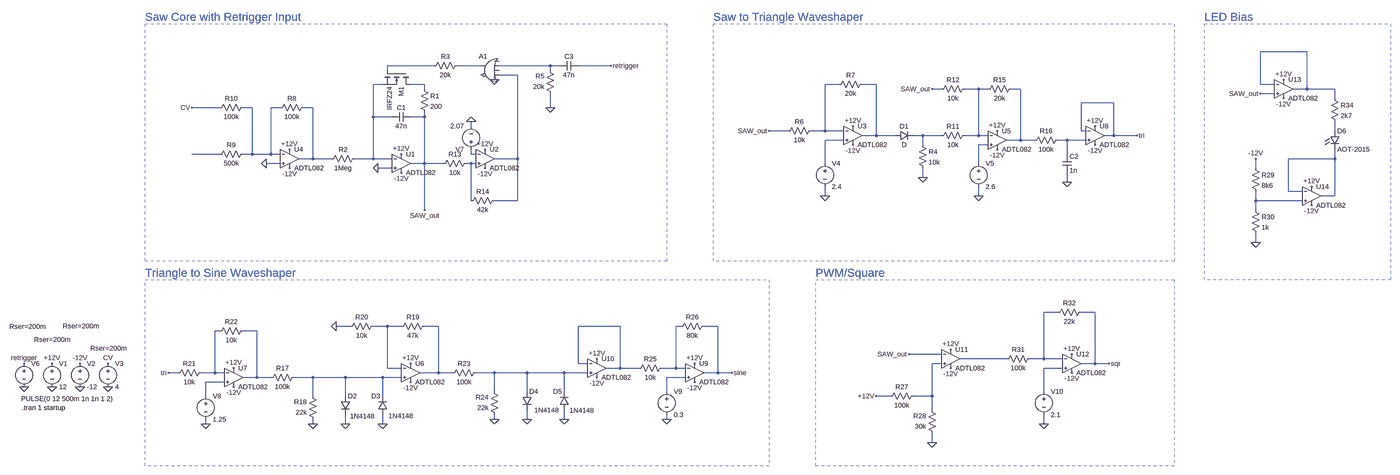
[diagram p0: schematic LFO with trigger.asc, whole sheet]
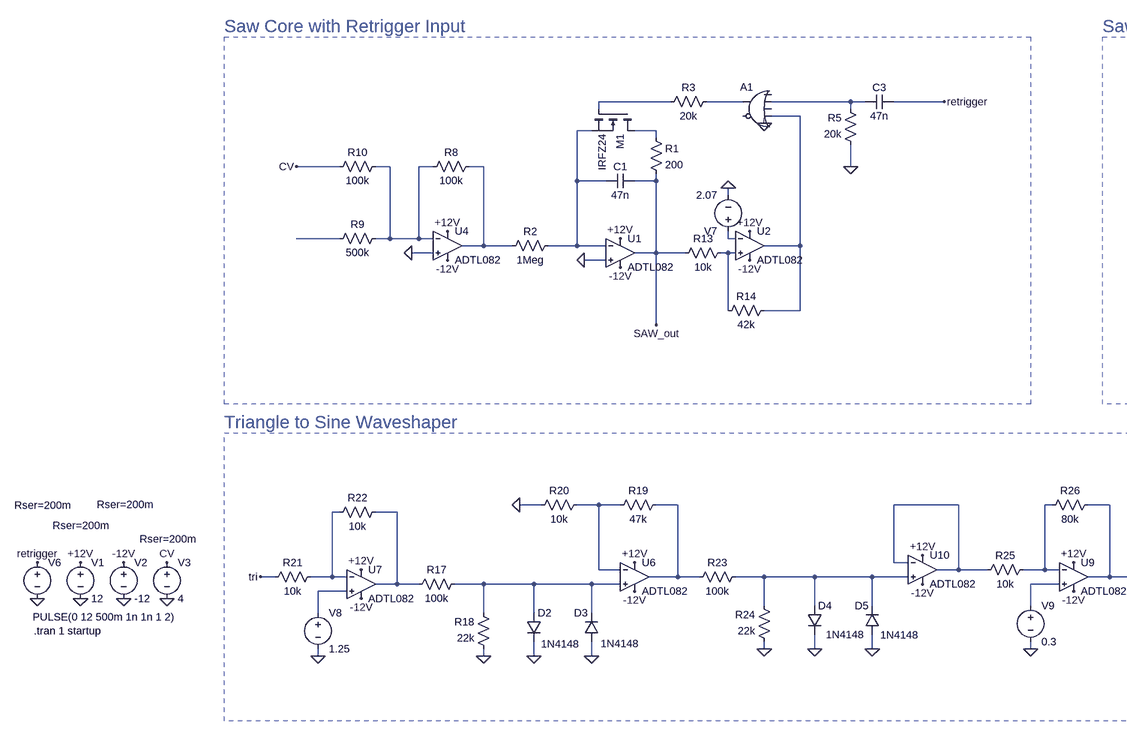
[diagram p1: schematic LFO with trigger.asc, part, row 1 of 1, column 1 of 2]
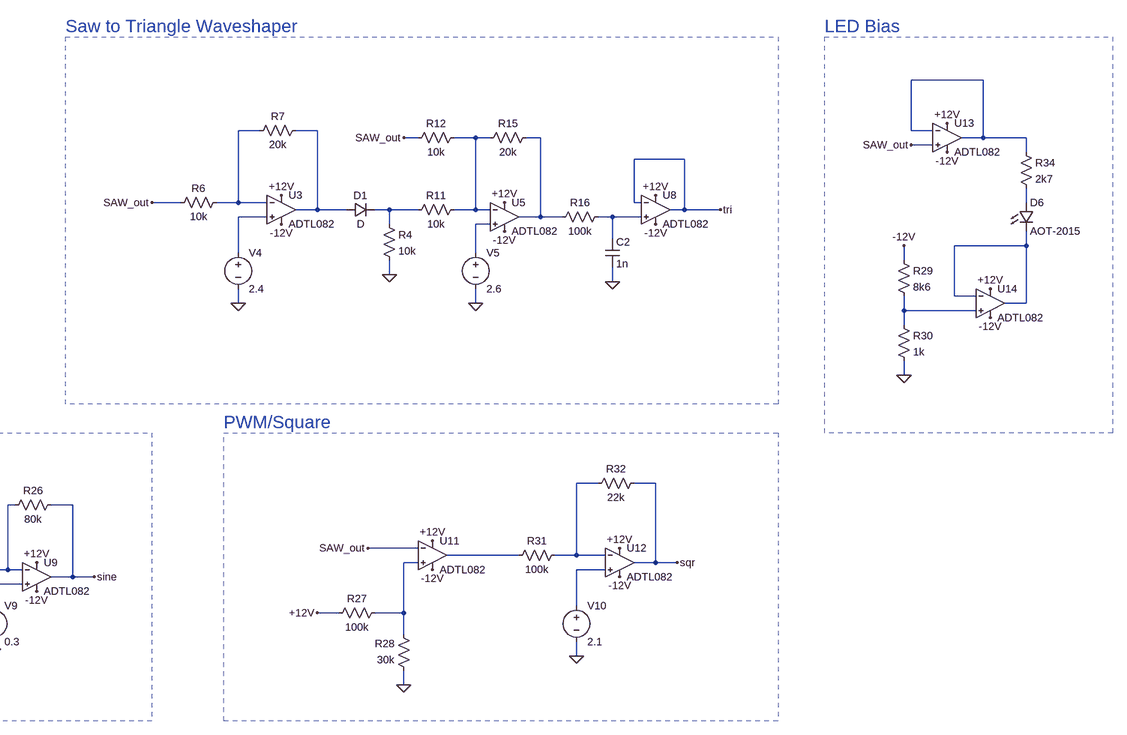
[diagram p2: schematic LFO with trigger.asc, part, row 1 of 1, column 2 of 2]
LFO with trigger.asc, the LTspice schematic file:
Version 4
SHEET 1 6664 1796
WIRE 4800 -768 4640 -768
WIRE 1760 -720 1600 -720
WIRE 1920 -720 1840 -720
WIRE 2160 -720 1984 -720
WIRE 2192 -720 2160 -720
WIRE 2368 -720 2256 -720
WIRE 1600 -704 1600 -720
WIRE 2160 -704 2160 -720
WIRE 2048 -688 1984 -688
WIRE 1584 -656 1552 -656
WIRE 1728 -656 1680 -656
WIRE 3152 -656 3104 -656
WIRE 3280 -656 3232 -656
WIRE 4640 -656 4640 -768
WIRE 4688 -656 4640 -656
WIRE 1728 -640 1728 -656
WIRE 3504 -640 3472 -640
WIRE 3632 -640 3584 -640
WIRE 3664 -640 3632 -640
WIRE 3776 -640 3744 -640
WIRE 4800 -640 4800 -768
WIRE 4800 -640 4752 -640
WIRE 4896 -640 4800 -640
WIRE 4688 -624 4640 -624
WIRE 4896 -608 4896 -640
WIRE 4096 -592 3984 -592
WIRE 1024 -576 928 -576
WIRE 1136 -576 1104 -576
WIRE 1232 -576 1200 -576
WIRE 1344 -576 1312 -576
WIRE 2160 -576 2160 -624
WIRE 1552 -544 1552 -656
WIRE 1616 -544 1552 -544
WIRE 1728 -544 1728 -560
WIRE 1728 -544 1680 -544
WIRE 1888 -512 1888 -528
WIRE 2976 -496 2912 -496
WIRE 3104 -496 3104 -656
WIRE 3104 -496 3056 -496
WIRE 3168 -496 3104 -496
WIRE 3984 -496 3984 -592
WIRE 4000 -496 3984 -496
WIRE 4896 -496 4896 -528
WIRE 3280 -480 3280 -656
WIRE 3280 -480 3232 -480
WIRE 3344 -480 3280 -480
WIRE 3440 -480 3408 -480
WIRE 3504 -480 3440 -480
WIRE 3632 -480 3632 -640
WIRE 3632 -480 3584 -480
WIRE 3664 -480 3632 -480
WIRE 4096 -480 4096 -592
WIRE 4096 -480 4064 -480
WIRE 4176 -480 4096 -480
WIRE 3168 -464 3104 -464
WIRE 3776 -464 3776 -640
WIRE 3776 -464 3728 -464
WIRE 3824 -464 3776 -464
WIRE 3936 -464 3904 -464
WIRE 4000 -464 3936 -464
WIRE 3440 -448 3440 -480
WIRE 3664 -448 3632 -448
WIRE 1024 -416 928 -416
WIRE 1136 -416 1136 -576
WIRE 1136 -416 1104 -416
WIRE 1200 -416 1200 -576
WIRE 1200 -416 1136 -416
WIRE 1232 -416 1200 -416
WIRE 1888 -416 1888 -432
WIRE 1904 -416 1888 -416
WIRE 3936 -416 3936 -464
WIRE 1344 -400 1344 -576
WIRE 1344 -400 1296 -400
WIRE 1408 -400 1344 -400
WIRE 1552 -400 1552 -544
WIRE 1552 -400 1488 -400
WIRE 1616 -400 1552 -400
WIRE 2048 -400 2048 -688
WIRE 2048 -400 1968 -400
WIRE 4896 -400 4896 -432
WIRE 4896 -400 4736 -400
WIRE 1232 -384 1184 -384
WIRE 1728 -384 1728 -544
WIRE 1728 -384 1680 -384
WIRE 1792 -384 1728 -384
WIRE 1888 -384 1872 -384
WIRE 1904 -384 1888 -384
WIRE 3104 -384 3104 -464
WIRE 3632 -384 3632 -448
WIRE 1616 -368 1568 -368
WIRE 4624 -368 4624 -400
WIRE 3440 -336 3440 -368
WIRE 3936 -320 3936 -352
WIRE 4736 -288 4736 -400
WIRE 4784 -288 4736 -288
WIRE 3104 -272 3104 -304
WIRE 3632 -272 3632 -304
WIRE 4896 -272 4896 -400
WIRE 4896 -272 4848 -272
WIRE 1888 -256 1888 -384
WIRE 2048 -256 2048 -400
WIRE 2048 -256 1968 -256
WIRE 4624 -256 4624 -288
WIRE 4784 -256 4624 -256
WIRE 1728 -224 1728 -384
WIRE 4624 -224 4624 -256
WIRE 4624 -112 4624 -144
WIRE 3904 128 3856 128
WIRE 4032 128 3984 128
WIRE 1472 176 1424 176
WIRE 1600 176 1552 176
WIRE 1648 176 1600 176
WIRE 1776 176 1728 176
WIRE 2400 176 2256 176
WIRE 2608 176 2592 176
WIRE 2736 176 2688 176
WIRE 1024 192 1008 192
WIRE 1152 192 1104 192
WIRE 3504 272 3392 272
WIRE 3728 288 3568 288
WIRE 3856 288 3856 128
WIRE 3856 288 3808 288
WIRE 3920 288 3856 288
WIRE 2256 304 2256 176
WIRE 2288 304 2256 304
WIRE 3504 304 3472 304
WIRE 4032 304 4032 128
WIRE 4032 304 3984 304
WIRE 4080 304 4032 304
WIRE 1600 320 1600 176
WIRE 1648 320 1600 320
WIRE 2400 320 2400 176
WIRE 2400 320 2352 320
WIRE 2464 320 2400 320
WIRE 2592 320 2592 176
WIRE 2592 320 2544 320
WIRE 2624 320 2592 320
WIRE 3920 320 3856 320
WIRE 880 336 848 336
WIRE 1008 336 1008 192
WIRE 1008 336 960 336
WIRE 1040 336 1008 336
WIRE 1776 336 1776 176
WIRE 1776 336 1712 336
WIRE 1824 336 1776 336
WIRE 1968 336 1904 336
WIRE 2080 336 1968 336
WIRE 2208 336 2080 336
WIRE 2288 336 2208 336
WIRE 2736 336 2736 176
WIRE 2736 336 2688 336
WIRE 2784 336 2736 336
WIRE 1152 352 1152 192
WIRE 1152 352 1104 352
WIRE 1200 352 1152 352
WIRE 1344 352 1280 352
WIRE 1456 352 1344 352
WIRE 1584 352 1456 352
WIRE 1648 352 1584 352
WIRE 2624 352 2560 352
WIRE 1040 368 976 368
WIRE 1968 400 1968 336
WIRE 2080 400 2080 336
WIRE 2208 400 2208 336
WIRE 2560 400 2560 352
WIRE 3856 400 3856 320
WIRE 976 416 976 368
WIRE 1344 416 1344 352
WIRE 1456 416 1456 352
WIRE 1584 416 1584 352
WIRE 3328 416 3280 416
WIRE 3472 416 3472 304
WIRE 3472 416 3408 416
WIRE 3472 464 3472 416
WIRE 1968 496 1968 480
WIRE 2080 496 2080 464
WIRE 2208 496 2208 464
WIRE 2560 496 2560 480
WIRE 976 512 976 496
WIRE 1344 512 1344 496
WIRE 1456 512 1456 480
WIRE 1584 512 1584 480
WIRE 3856 512 3856 480
WIRE 3472 576 3472 544
FLAG 448 384 0
FLAG 544 384 0
FLAG 640 384 0
FLAG 448 304 +12V
FLAG 544 304 -12V
FLAG 640 304 CV
FLAG 1648 -416 +12V
FLAG 1648 -352 -12V
FLAG 1568 -368 0
FLAG 1264 -432 +12V
FLAG 1264 -368 -12V
FLAG 1184 -384 0
FLAG 928 -576 CV
FLAG 352 384 0
FLAG 352 304 retrigger
FLAG 1888 -528 0
FLAG 1936 -432 +12V
FLAG 1936 -368 -12V
FLAG 2368 -720 retrigger
FLAG 2160 -576 0
FLAG 1968 -672 0
FLAG 1728 -224 SAW_out
FLAG 2912 -496 SAW_out
FLAG 3200 -512 +12V
FLAG 3200 -448 -12V
FLAG 3440 -336 0
FLAG 3104 -272 0
FLAG 3696 -496 +12V
FLAG 3696 -432 -12V
FLAG 3472 -640 SAW_out
FLAG 3632 -272 0
FLAG 3936 -320 0
FLAG 1344 512 0
FLAG 1456 512 0
FLAG 1584 512 0
FLAG 4176 -480 tri
FLAG 848 336 tri
FLAG 1072 320 +12V
FLAG 1072 384 -12V
FLAG 976 512 0
FLAG 4032 -512 +12V
FLAG 4032 -448 -12V
FLAG 1680 304 +12V
FLAG 1680 368 -12V
FLAG 1424 176 0
FLAG 1968 496 0
FLAG 2080 496 0
FLAG 2208 496 0
FLAG 2656 304 +12V
FLAG 2656 368 -12V
FLAG 2560 496 0
FLAG 2320 288 +12V
FLAG 2320 352 -12V
FLAG 2784 336 sine
FLAG 3536 256 +12V
FLAG 3536 320 -12V
FLAG 3472 576 0
FLAG 3280 416 +12V
FLAG 3392 272 SAW_out
FLAG 3952 272 +12V
FLAG 3952 336 -12V
FLAG 3856 512 0
FLAG 4080 304 sqr
FLAG 4720 -672 +12V
FLAG 4720 -608 -12V
FLAG 4640 -624 SAW_out
FLAG 4816 -304 +12V
FLAG 4816 -240 -12V
FLAG 4624 -400 -12V
FLAG 4624 -112 0
SYMBOL voltage 448 288 R0
WINDOW 123 0 0 Left 0
WINDOW 39 -62 -66 Left 2
SYMATTR SpiceLine Rser=200m
SYMATTR InstName V1
SYMATTR Value 12
SYMBOL voltage 544 288 R0
WINDOW 123 0 0 Left 0
WINDOW 39 -60 -113 Left 2
SYMATTR SpiceLine Rser=200m
SYMATTR InstName V2
SYMATTR Value -12
SYMBOL voltage 640 288 R0
WINDOW 123 0 0 Left 0
WINDOW 39 -61 -36 Left 2
SYMATTR SpiceLine Rser=200m
SYMATTR InstName V3
SYMATTR Value 4
SYMBOL OpAmps\\ADTL082 1648 -448 R0
SYMATTR InstName U1
SYMBOL cap 1680 -560 R90
WINDOW 0 0 32 VBottom 2
WINDOW 3 32 32 VTop 2
SYMATTR InstName C1
SYMATTR Value 47n
SYMBOL res 1504 -416 R90
WINDOW 0 0 56 VBottom 2
WINDOW 3 32 56 VTop 2
SYMATTR InstName R2
SYMATTR Value 1Meg
SYMBOL OpAmps\\ADTL082 1264 -464 R0
SYMATTR InstName U4
SYMBOL res 1328 -592 R90
WINDOW 0 0 56 VBottom 2
WINDOW 3 32 56 VTop 2
SYMATTR InstName R8
SYMATTR Value 100k
SYMBOL res 1120 -432 R90
WINDOW 0 0 56 VBottom 2
WINDOW 3 32 56 VTop 2
SYMATTR InstName R9
SYMATTR Value 500k
SYMBOL res 1120 -592 R90
WINDOW 0 0 56 VBottom 2
WINDOW 3 32 56 VTop 2
SYMATTR InstName R10
SYMATTR Value 100k
SYMBOL voltage 352 288 R0
WINDOW 123 0 0 Left 0
WINDOW 39 75 -111 Right 2
WINDOW 3 -10 137 Left 2
SYMATTR SpiceLine Rser=200m
SYMATTR Value PULSE(0 12 500m 1n 1n 1 2)
SYMATTR InstName V6
SYMBOL nmos 1680 -704 R90
SYMATTR InstName M1
SYMATTR Value IRFZ24
SYMBOL res 1712 -656 R0
SYMATTR InstName R1
SYMATTR Value 200
SYMBOL voltage 1888 -416 R180
WINDOW 123 0 0 Left 0
WINDOW 39 0 0 Left 0
SYMATTR InstName V7
SYMATTR Value 2.07
SYMBOL OpAmps\\ADTL082 1936 -464 R0
SYMATTR InstName U2
SYMBOL res 1888 -400 R90
WINDOW 0 0 56 VBottom 2
WINDOW 3 32 56 VTop 2
SYMATTR InstName R13
SYMATTR Value 10k
SYMBOL res 1984 -272 R90
WINDOW 0 0 56 VBottom 2
WINDOW 3 32 56 VTop 2
SYMATTR InstName R14
SYMATTR Value 42k
SYMBOL cap 2256 -736 R90
WINDOW 0 0 32 VBottom 2
WINDOW 3 32 32 VTop 2
SYMATTR InstName C3
SYMATTR Value 47n
SYMBOL res 2176 -608 R180
WINDOW 0 36 76 Left 2
WINDOW 3 36 40 Left 2
SYMATTR InstName R5
SYMATTR Value 20k
SYMBOL Digital\\or 1952 -768 M0
WINDOW 3 0 0 Invisible 0
SYMATTR Value Ref=1
SYMATTR InstName A1
SYMATTR Value2 Vhigh=10 Vlow=0
SYMBOL res 1856 -736 R90
WINDOW 0 0 56 VBottom 2
WINDOW 3 32 56 VTop 2
SYMATTR InstName R3
SYMATTR Value 20k
SYMBOL diode 3344 -464 R270
WINDOW 0 32 32 VTop 2
WINDOW 3 0 32 VBottom 2
SYMATTR InstName D1
SYMBOL res 3424 -464 R0
SYMATTR InstName R4
SYMATTR Value 10k
SYMBOL res 3072 -512 R90
WINDOW 0 0 56 VBottom 2
WINDOW 3 32 56 VTop 2
SYMATTR InstName R6
SYMATTR Value 10k
SYMBOL OpAmps\\ADTL082 3200 -544 R0
SYMATTR InstName U3
SYMBOL res 3248 -672 R90
WINDOW 0 0 56 VBottom 2
WINDOW 3 32 56 VTop 2
SYMATTR InstName R7
SYMATTR Value 20k
SYMBOL voltage 3104 -400 R0
WINDOW 123 0 0 Left 0
WINDOW 39 0 0 Left 0
SYMATTR InstName V4
SYMATTR Value 2.4
SYMBOL res 3600 -496 R90
WINDOW 0 0 56 VBottom 2
WINDOW 3 32 56 VTop 2
SYMATTR InstName R11
SYMATTR Value 10k
SYMBOL res 3600 -656 R90
WINDOW 0 0 56 VBottom 2
WINDOW 3 32 56 VTop 2
SYMATTR InstName R12
SYMATTR Value 10k
SYMBOL res 3760 -656 R90
WINDOW 0 0 56 VBottom 2
WINDOW 3 32 56 VTop 2
SYMATTR InstName R15
SYMATTR Value 20k
SYMBOL OpAmps\\ADTL082 3696 -528 R0
SYMATTR InstName U5
SYMBOL voltage 3632 -400 R0
WINDOW 123 0 0 Left 0
WINDOW 39 0 0 Left 0
SYMATTR InstName V5
SYMATTR Value 2.6
SYMBOL cap 3920 -416 R0
SYMATTR InstName C2
SYMATTR Value 1n
SYMBOL res 3920 -480 R90
WINDOW 0 0 56 VBottom 2
WINDOW 3 32 56 VTop 2
SYMATTR InstName R16
SYMATTR Value 100k
SYMBOL res 1296 336 R90
WINDOW 0 0 56 VBottom 2
WINDOW 3 32 56 VTop 2
SYMATTR InstName R17
SYMATTR Value 100k
SYMBOL res 1360 512 R180
WINDOW 0 36 76 Left 2
WINDOW 3 36 40 Left 2
SYMATTR InstName R18
SYMATTR Value 22k
SYMBOL diode 1440 416 R0
WINDOW 3 32 69 Left 2
SYMATTR Value 1N4148
SYMATTR InstName D2
SYMBOL diode 1600 480 R180
WINDOW 0 24 64 Left 2
WINDOW 3 -89 -4 Left 2
SYMATTR InstName D3
SYMATTR Value 1N4148
SYMBOL OpAmps\\ADTL082 1072 288 R0
SYMATTR InstName U7
SYMBOL res 976 320 R90
WINDOW 0 0 56 VBottom 2
WINDOW 3 32 56 VTop 2
SYMATTR InstName R21
SYMATTR Value 10k
SYMBOL res 1120 176 R90
WINDOW 0 0 56 VBottom 2
WINDOW 3 32 56 VTop 2
SYMATTR InstName R22
SYMATTR Value 10k
SYMBOL voltage 976 400 R0
WINDOW 123 0 0 Left 0
WINDOW 39 0 0 Left 0
SYMATTR InstName V8
SYMATTR Value 1.25
SYMBOL OpAmps\\ADTL082 4032 -544 R0
SYMATTR InstName U8
SYMBOL OpAmps\\ADTL082 1680 272 R0
SYMATTR InstName U6
SYMBOL res 1744 160 R90
WINDOW 0 0 56 VBottom 2
WINDOW 3 32 56 VTop 2
SYMATTR InstName R19
SYMATTR Value 47k
SYMBOL res 1568 160 R90
WINDOW 0 0 56 VBottom 2
WINDOW 3 32 56 VTop 2
SYMATTR InstName R20
SYMATTR Value 10k
SYMBOL res 1920 320 R90
WINDOW 0 0 56 VBottom 2
WINDOW 3 32 56 VTop 2
SYMATTR InstName R23
SYMATTR Value 100k
SYMBOL res 1984 496 R180
WINDOW 0 36 76 Left 2
WINDOW 3 36 40 Left 2
SYMATTR InstName R24
SYMATTR Value 22k
SYMBOL diode 2064 400 R0
WINDOW 3 162 65 Left 2
SYMATTR Value 1N4148
SYMATTR InstName D4
SYMBOL diode 2224 464 R180
WINDOW 0 24 64 Left 2
WINDOW 3 34 0 Left 2
SYMATTR InstName D5
SYMATTR Value 1N4148
SYMBOL OpAmps\\ADTL082 2656 272 R0
SYMATTR InstName U9
SYMBOL res 2560 304 R90
WINDOW 0 0 56 VBottom 2
WINDOW 3 32 56 VTop 2
SYMATTR InstName R25
SYMATTR Value 10k
SYMBOL res 2704 160 R90
WINDOW 0 0 56 VBottom 2
WINDOW 3 32 56 VTop 2
SYMATTR InstName R26
SYMATTR Value 80k
SYMBOL voltage 2560 384 R0
WINDOW 123 0 0 Left 0
WINDOW 39 0 0 Left 0
SYMATTR InstName V9
SYMATTR Value 0.3
SYMBOL OpAmps\\ADTL082 2320 256 R0
SYMATTR InstName U10
SYMBOL OpAmps\\ADTL082 3536 224 R0
SYMATTR InstName U11
SYMBOL res 3424 400 R90
WINDOW 0 0 56 VBottom 2
WINDOW 3 32 56 VTop 2
SYMATTR InstName R27
SYMATTR Value 100k
SYMBOL res 3488 560 R180
WINDOW 0 36 76 Left 2
WINDOW 3 36 40 Left 2
SYMATTR InstName R28
SYMATTR Value 30k
SYMBOL res 3824 272 R90
WINDOW 0 0 56 VBottom 2
WINDOW 3 32 56 VTop 2
SYMATTR InstName R31
SYMATTR Value 100k
SYMBOL OpAmps\\ADTL082 3952 240 R0
SYMATTR InstName U12
SYMBOL res 4000 112 R90
WINDOW 0 0 56 VBottom 2
WINDOW 3 32 56 VTop 2
SYMATTR InstName R32
SYMATTR Value 22k
SYMBOL voltage 3856 384 R0
WINDOW 123 0 0 Left 0
WINDOW 39 0 0 Left 0
SYMATTR InstName V10
SYMATTR Value 2.1
SYMBOL OpAmps\\ADTL082 4720 -704 R0
SYMATTR InstName U13
SYMBOL LED 4880 -496 R0
SYMATTR InstName D6
SYMATTR Value AOT-2015
SYMBOL res 4880 -624 R0
SYMATTR InstName R34
SYMATTR Value 2k7
SYMBOL OpAmps\\ADTL082 4816 -336 R0
SYMATTR InstName U14
SYMBOL res 4608 -384 R0
SYMATTR InstName R29
SYMATTR Value 8k6
SYMBOL res 4608 -240 R0
SYMATTR InstName R30
SYMATTR Value 1k
TEXT 344 456 Left 2 !.tran 1 startup
TEXT 768 -888 Left 4 ;Saw Core with Retrigger Input
TEXT 2720 -888 Left 4 ;Saw to Triangle Waveshaper
TEXT 768 -8 Left 4 ;Triangle to Sine Waveshaper
TEXT 3072 -8 Left 4 ;PWM/Square
TEXT 4448 -888 Left 4 ;LED Bias
RECTANGLE Normal 2560 -48 768 -864 2
RECTANGLE Normal 4304 -48 2720 -864 2
RECTANGLE Normal 2912 656 768 16 2
RECTANGLE Normal 4304 656 3072 16 2
RECTANGLE Normal 5088 16 4448 -864 2

The netlist it stands for:
* LFO with trigger.asc
V1 +12V 0 12 Rser=200m
V2 -12V 0 -12 Rser=200m
V3 CV 0 4 Rser=200m
XU1 0 N006 +12V -12V SAW_out ADTL082  ; pins In+ In- V+ V- OUT
C1 SAW_out N006 47n
R2 N006 N013 1Meg
XU4 0 N012 +12V -12V N013 ADTL082  ; pins In+ In- V+ V- OUT
R8 N013 N012 100k
R9 N012 N019 500k
R10 N012 CV 100k
V6 retrigger 0 PULSE(0 12 500m 1n 1n 1 2) Rser=200m
M1 N007 N002 N006 N006 IRFZ24
R1 N007 SAW_out 200
V7 N020 0 2.07
XU2 N022 N020 +12V -12V N005 ADTL082  ; pins In+ In- V+ V- OUT
R13 N022 SAW_out 10k
R14 N005 N022 42k
C3 retrigger N004 47n
R5 0 N004 20k
A1 0 N004 0 N005 0 0 N003 0 OR Ref=1 Vhigh=10 Vlow=0
R3 N003 N002 20k
D1 N009 N015 D
R4 N015 0 10k
R6 N008 SAW_out 10k
XU3 N016 N008 +12V -12V N009 ADTL082  ; pins In+ In- V+ V- OUT
R7 N009 N008 20k
V4 N016 0 2.4
R11 N010 N015 10k
R12 N010 SAW_out 10k
R15 N011 N010 20k
XU5 N018 N010 +12V -12V N011 ADTL082  ; pins In+ In- V+ V- OUT
V5 N018 0 2.6
C2 N017 0 1n
R16 N017 N011 100k
R17 N035 N030 100k
R18 0 N035 22k
D2 N035 0 1N4148
D3 0 N035 1N4148
XU7 N037 N029 +12V -12V N030 ADTL082  ; pins In+ In- V+ V- OUT
R21 N029 tri 10k
R22 N030 N029 10k
V8 N037 0 1.25
XU8 N017 tri +12V -12V tri ADTL082  ; pins In+ In- V+ V- OUT
XU6 N035 N025 +12V -12V N026 ADTL082  ; pins In+ In- V+ V- OUT
R19 N026 N025 47k
R20 N025 0 10k
R23 N034 N026 100k
R24 0 N034 22k
D4 N034 0 1N4148
D5 0 N034 1N4148
XU9 N036 N028 +12V -12V sine ADTL082  ; pins In+ In- V+ V- OUT
R25 N028 N027 10k
R26 sine N028 80k
V9 N036 0 0.3
XU10 N034 N027 +12V -12V N027 ADTL082  ; pins In+ In- V+ V- OUT
XU11 N032 SAW_out +12V -12V N031 ADTL082  ; pins In+ In- V+ V- OUT
R27 N032 +12V 100k
R28 0 N032 30k
R31 N024 N031 100k
XU12 N033 N024 +12V -12V sqr ADTL082  ; pins In+ In- V+ V- OUT
R32 sqr N024 22k
V10 N033 0 2.1
XU13 SAW_out N001 +12V -12V N001 ADTL082  ; pins In+ In- V+ V- OUT
D6 N014 N021 AOT-2015
R34 N001 N014 2k7
XU14 N023 N021 +12V -12V N021 ADTL082  ; pins In+ In- V+ V- OUT
R29 -12V N023 8k6
R30 N023 0 1k
.model D D
.lib standard.dio
.model NMOS NMOS
.model PMOS PMOS
.lib standard.mos
.tran 1 startup
* Saw Core with Retrigger Input
* Saw to Triangle Waveshaper
* Triangle to Sine Waveshaper
* PWM/Square
* LED Bias
.lib ADI.lib
.backanno
.end